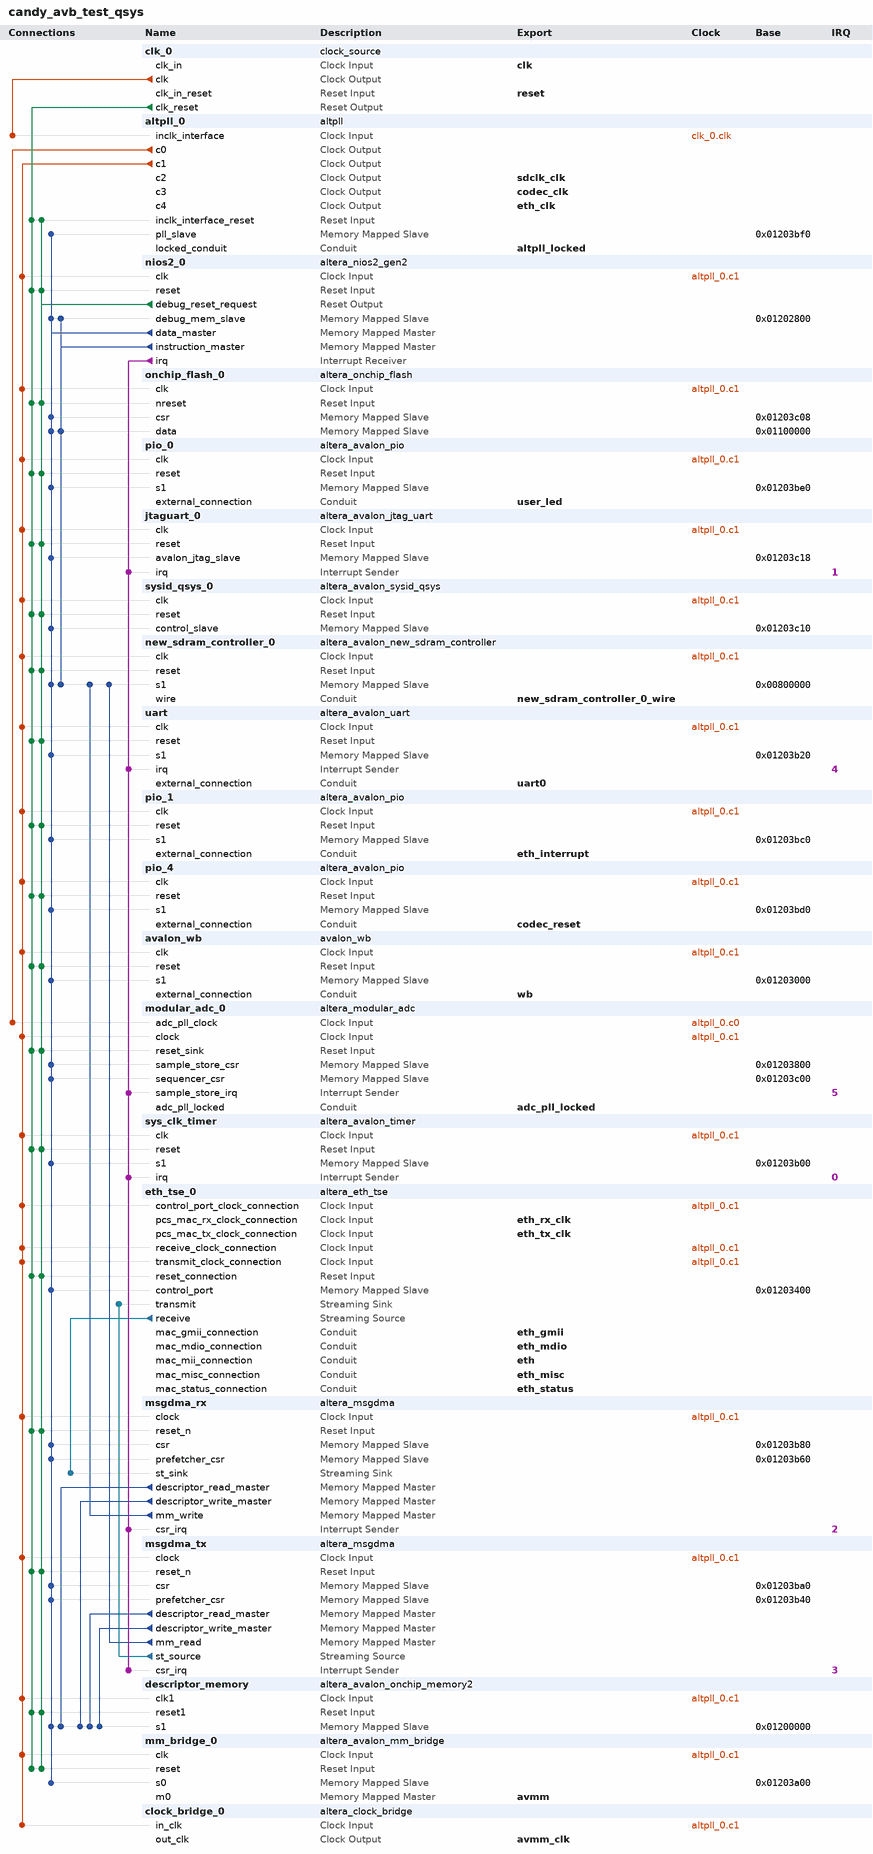
[diagram p0: system contents]
# Platform Designer (Qsys) system candy_avb_test_qsys, MAX 10 10M16SAU169C8G
# Parameters at their usual value, and those the tool derives, are not listed.
package require -exact qsys 18.1
create_system candy_avb_test_qsys
set_project_property DEVICE_FAMILY {MAX 10}
set_project_property DEVICE 10M16SAU169C8G

add_instance clk_0 clock_source 18.1
set_instance_parameter_value clk_0 clockFrequency 48000000

add_instance altpll_0 altpll 18.1
set_instance_parameter_value altpll_0 CLK0_DIVIDE_BY 24
set_instance_parameter_value altpll_0 CLK0_MULTIPLY_BY 5
set_instance_parameter_value altpll_0 CLK1_DIVIDE_BY 12
set_instance_parameter_value altpll_0 CLK1_DUTY_CYCLE 50
set_instance_parameter_value altpll_0 CLK1_MULTIPLY_BY 25
set_instance_parameter_value altpll_0 CLK1_PHASE_SHIFT 0
set_instance_parameter_value altpll_0 CLK2_DIVIDE_BY 12
set_instance_parameter_value altpll_0 CLK2_DUTY_CYCLE 50
set_instance_parameter_value altpll_0 CLK2_MULTIPLY_BY 25
set_instance_parameter_value altpll_0 CLK2_PHASE_SHIFT -83333
set_instance_parameter_value altpll_0 CLK3_DIVIDE_BY 2
set_instance_parameter_value altpll_0 CLK3_DUTY_CYCLE 50
set_instance_parameter_value altpll_0 CLK3_MULTIPLY_BY 1
set_instance_parameter_value altpll_0 CLK3_PHASE_SHIFT 0
set_instance_parameter_value altpll_0 CLK4_DIVIDE_BY 48
set_instance_parameter_value altpll_0 CLK4_DUTY_CYCLE 50
set_instance_parameter_value altpll_0 CLK4_MULTIPLY_BY 25
set_instance_parameter_value altpll_0 CLK4_PHASE_SHIFT 0
set_instance_parameter_value altpll_0 INCLK0_INPUT_FREQUENCY 20833
set_instance_parameter_value altpll_0 PORT_ARESET PORT_UNUSED
set_instance_parameter_value altpll_0 PORT_LOCKED PORT_USED
set_instance_parameter_value altpll_0 PORT_clk1 PORT_USED
set_instance_parameter_value altpll_0 PORT_clk2 PORT_USED
set_instance_parameter_value altpll_0 PORT_clk3 PORT_USED
set_instance_parameter_value altpll_0 PORT_clk4 PORT_USED

add_instance nios2_0 altera_nios2_gen2 18.1
set_instance_parameter_value nios2_0 dcache_size 2048
set_instance_parameter_value nios2_0 exceptionSlave new_sdram_controller_0.s1
set_instance_parameter_value nios2_0 icache_size 4096
set_instance_parameter_value nios2_0 impl Fast
set_instance_parameter_value nios2_0 resetSlave onchip_flash_0.data

add_instance onchip_flash_0 altera_onchip_flash 18.1
set_instance_parameter_value onchip_flash_0 CONFIGURATION_MODE {Single Uncompressed Image}
set_instance_parameter_value onchip_flash_0 READ_BURST_COUNT 4
set_instance_parameter_value onchip_flash_0 SECTOR_ACCESS_MODE {Read and write,Read and write,Read and write,Read and write,Read and write}
set_instance_parameter_value onchip_flash_0 initFlashContent false
set_instance_parameter_value onchip_flash_0 initializationFileName altera_onchip_flash.hex
set_instance_parameter_value onchip_flash_0 useNonDefaultInitFile false

add_instance pio_0 altera_avalon_pio 18.1
set_instance_parameter_value pio_0 direction Output
set_instance_parameter_value pio_0 width 2

add_instance jtaguart_0 altera_avalon_jtag_uart 18.1
set_instance_parameter_value jtaguart_0 simInteractiveOptions NO_INTERACTIVE_WINDOWS

add_instance sysid_qsys_0 altera_avalon_sysid_qsys 18.1
set_instance_parameter_value sysid_qsys_0 id 0

add_instance new_sdram_controller_0 altera_avalon_new_sdram_controller 18.1
set_instance_parameter_value new_sdram_controller_0 TAC 5.4
set_instance_parameter_value new_sdram_controller_0 TMRD 2
set_instance_parameter_value new_sdram_controller_0 TRCD 21.0
set_instance_parameter_value new_sdram_controller_0 TRFC 63.0
set_instance_parameter_value new_sdram_controller_0 TRP 42.0
set_instance_parameter_value new_sdram_controller_0 TWR 2.0
set_instance_parameter_value new_sdram_controller_0 casLatency 3
set_instance_parameter_value new_sdram_controller_0 columnWidth 8
set_instance_parameter_value new_sdram_controller_0 dataWidth 16
set_instance_parameter_value new_sdram_controller_0 generateSimulationModel false
set_instance_parameter_value new_sdram_controller_0 model single_Micron_MT48LC4M32B2_7_chip
set_instance_parameter_value new_sdram_controller_0 numberOfBanks 4
set_instance_parameter_value new_sdram_controller_0 numberOfChipSelects 1
set_instance_parameter_value new_sdram_controller_0 powerUpDelay 200.0
set_instance_parameter_value new_sdram_controller_0 refreshPeriod 15.6
set_instance_parameter_value new_sdram_controller_0 rowWidth 12

add_instance uart altera_avalon_uart 18.1
set_instance_parameter_value uart baud 115200
set_instance_parameter_value uart dataBits 8
set_instance_parameter_value uart fixedBaud true
set_instance_parameter_value uart parity NONE
set_instance_parameter_value uart stopBits 1
set_instance_parameter_value uart useCtsRts true

add_instance pio_1 altera_avalon_pio 18.1
set_instance_parameter_value pio_1 direction Bidir
set_instance_parameter_value pio_1 resetValue 1
set_instance_parameter_value pio_1 width 1

add_instance pio_4 altera_avalon_pio 18.1
set_instance_parameter_value pio_4 direction Output
set_instance_parameter_value pio_4 resetValue 1
set_instance_parameter_value pio_4 width 1

add_instance avalon_wb avalon_wb 1.0

add_instance modular_adc_0 altera_modular_adc 18.1
set_instance_parameter_value modular_adc_0 CLOCK_FREQ 100000000
set_instance_parameter_value modular_adc_0 CORE_VAR 0
set_instance_parameter_value modular_adc_0 DEVICE_PART 10M16SAU169C8G
set_instance_parameter_value modular_adc_0 clkdiv 2
set_instance_parameter_value modular_adc_0 int_vref_vr 3.3
set_instance_parameter_value modular_adc_0 refsel 1
set_instance_parameter_value modular_adc_0 sample_rate 0
set_instance_parameter_value modular_adc_0 seq_order_length 2
set_instance_parameter_value modular_adc_0 seq_order_slot_1 3
set_instance_parameter_value modular_adc_0 seq_order_slot_2 6
set_instance_parameter_value modular_adc_0 seq_order_slot_3 30
set_instance_parameter_value modular_adc_0 seq_order_slot_4 30
set_instance_parameter_value modular_adc_0 seq_order_slot_5 30
set_instance_parameter_value modular_adc_0 seq_order_slot_6 30
set_instance_parameter_value modular_adc_0 seq_order_slot_7 30
set_instance_parameter_value modular_adc_0 use_ch0 true
set_instance_parameter_value modular_adc_0 use_ch2 true
set_instance_parameter_value modular_adc_0 use_ch3 true
set_instance_parameter_value modular_adc_0 use_ch4 true
set_instance_parameter_value modular_adc_0 use_ch5 true
set_instance_parameter_value modular_adc_0 use_ch6 true
set_instance_parameter_value modular_adc_0 use_ch7 true
set_instance_parameter_value modular_adc_0 use_ch8 true
set_instance_parameter_value modular_adc_0 use_tsd false

add_instance sys_clk_timer altera_avalon_timer 18.1
set_instance_parameter_value sys_clk_timer fixedPeriod true
set_instance_parameter_value sys_clk_timer period 1
set_instance_parameter_value sys_clk_timer periodUnits MSEC

add_instance eth_tse_0 altera_eth_tse 18.1
set_instance_parameter_value eth_tse_0 XCVR_RCFG_JTAG_ENABLE 0
set_instance_parameter_value eth_tse_0 XCVR_SET_CAPABILITY_REG_ENABLE 0
set_instance_parameter_value eth_tse_0 XCVR_SET_CSR_SOFT_LOGIC_ENABLE 0
set_instance_parameter_value eth_tse_0 XCVR_SET_PRBS_SOFT_LOGIC_ENABLE 0
set_instance_parameter_value eth_tse_0 XCVR_SET_USER_IDENTIFIER 0
set_instance_parameter_value eth_tse_0 core_variation MAC_ONLY
set_instance_parameter_value eth_tse_0 eg_addr 8
set_instance_parameter_value eth_tse_0 enable_hd_logic true
set_instance_parameter_value eth_tse_0 enable_mac_flow_ctrl false
set_instance_parameter_value eth_tse_0 enable_magic_detect false
set_instance_parameter_value eth_tse_0 enable_shift16 true
set_instance_parameter_value eth_tse_0 ifGMII MII_GMII
set_instance_parameter_value eth_tse_0 ing_addr 8
set_instance_parameter_value eth_tse_0 mdio_clk_div 50
set_instance_parameter_value eth_tse_0 stat_cnt_ena true
set_instance_parameter_value eth_tse_0 transceiver_type NONE

add_instance msgdma_rx altera_msgdma 18.1
set_instance_parameter_value msgdma_rx BURST_ENABLE 0
set_instance_parameter_value msgdma_rx DATA_FIFO_DEPTH 256
set_instance_parameter_value msgdma_rx DATA_WIDTH 32
set_instance_parameter_value msgdma_rx DESCRIPTOR_FIFO_DEPTH 128
set_instance_parameter_value msgdma_rx ENHANCED_FEATURES 0
set_instance_parameter_value msgdma_rx ERROR_ENABLE 1
set_instance_parameter_value msgdma_rx ERROR_WIDTH 6
set_instance_parameter_value msgdma_rx MAX_BURST_COUNT 16
set_instance_parameter_value msgdma_rx MAX_BYTE 1024
set_instance_parameter_value msgdma_rx MODE 2
set_instance_parameter_value msgdma_rx PACKET_ENABLE 1
set_instance_parameter_value msgdma_rx PREFETCHER_ENABLE 1
set_instance_parameter_value msgdma_rx PREFETCHER_MAX_READ_BURST_COUNT 8
set_instance_parameter_value msgdma_rx TRANSFER_TYPE {Aligned Accesses}

add_instance msgdma_tx altera_msgdma 18.1
set_instance_parameter_value msgdma_tx BURST_ENABLE 0
set_instance_parameter_value msgdma_tx DATA_FIFO_DEPTH 256
set_instance_parameter_value msgdma_tx DATA_WIDTH 32
set_instance_parameter_value msgdma_tx DESCRIPTOR_FIFO_DEPTH 128
set_instance_parameter_value msgdma_tx ENHANCED_FEATURES 0
set_instance_parameter_value msgdma_tx ERROR_ENABLE 1
set_instance_parameter_value msgdma_tx ERROR_WIDTH 1
set_instance_parameter_value msgdma_tx MAX_BURST_COUNT 16
set_instance_parameter_value msgdma_tx MAX_BYTE 1024
set_instance_parameter_value msgdma_tx MODE 1
set_instance_parameter_value msgdma_tx PACKET_ENABLE 1
set_instance_parameter_value msgdma_tx PREFETCHER_ENABLE 1
set_instance_parameter_value msgdma_tx PREFETCHER_MAX_READ_BURST_COUNT 8
set_instance_parameter_value msgdma_tx TRANSFER_TYPE {Aligned Accesses}

add_instance descriptor_memory altera_avalon_onchip_memory2 18.1
set_instance_parameter_value descriptor_memory dataWidth 32
set_instance_parameter_value descriptor_memory dualPort false
set_instance_parameter_value descriptor_memory initMemContent false
set_instance_parameter_value descriptor_memory initializationFileName onchip_mem.hex
set_instance_parameter_value descriptor_memory memorySize 8192

add_instance mm_bridge_0 altera_avalon_mm_bridge 18.1
set_instance_parameter_value mm_bridge_0 ADDRESS_UNITS SYMBOLS
set_instance_parameter_value mm_bridge_0 ADDRESS_WIDTH 8
set_instance_parameter_value mm_bridge_0 DATA_WIDTH 32
set_instance_parameter_value mm_bridge_0 MAX_PENDING_RESPONSES 4
set_instance_parameter_value mm_bridge_0 PIPELINE_COMMAND 0
set_instance_parameter_value mm_bridge_0 PIPELINE_RESPONSE 0
set_instance_parameter_value mm_bridge_0 USE_AUTO_ADDRESS_WIDTH 0

add_instance clock_bridge_0 altera_clock_bridge 18.1
set_instance_parameter_value clock_bridge_0 DERIVED_CLOCK_RATE 100000000
set_instance_parameter_value clock_bridge_0 EXPLICIT_CLOCK_RATE 0

# connections
add_connection altpll_0.c0 modular_adc_0.adc_pll_clock clock
add_connection altpll_0.c1 avalon_wb.clk clock
add_connection altpll_0.c1 clock_bridge_0.in_clk clock
add_connection altpll_0.c1 descriptor_memory.clk1 clock
add_connection altpll_0.c1 eth_tse_0.control_port_clock_connection clock
add_connection altpll_0.c1 eth_tse_0.receive_clock_connection clock
add_connection altpll_0.c1 eth_tse_0.transmit_clock_connection clock
add_connection altpll_0.c1 jtaguart_0.clk clock
add_connection altpll_0.c1 mm_bridge_0.clk clock
add_connection altpll_0.c1 modular_adc_0.clock clock
add_connection altpll_0.c1 msgdma_rx.clock clock
add_connection altpll_0.c1 msgdma_tx.clock clock
add_connection altpll_0.c1 new_sdram_controller_0.clk clock
add_connection altpll_0.c1 nios2_0.clk clock
add_connection altpll_0.c1 onchip_flash_0.clk clock
add_connection altpll_0.c1 pio_0.clk clock
add_connection altpll_0.c1 pio_1.clk clock
add_connection altpll_0.c1 pio_4.clk clock
add_connection altpll_0.c1 sys_clk_timer.clk clock
add_connection altpll_0.c1 sysid_qsys_0.clk clock
add_connection altpll_0.c1 uart.clk clock
add_connection clk_0.clk altpll_0.inclk_interface clock
add_connection clk_0.clk_reset altpll_0.inclk_interface_reset reset
add_connection clk_0.clk_reset avalon_wb.reset reset
add_connection clk_0.clk_reset descriptor_memory.reset1 reset
add_connection clk_0.clk_reset eth_tse_0.reset_connection reset
add_connection clk_0.clk_reset jtaguart_0.reset reset
add_connection clk_0.clk_reset mm_bridge_0.reset reset
add_connection clk_0.clk_reset modular_adc_0.reset_sink reset
add_connection clk_0.clk_reset msgdma_rx.reset_n reset
add_connection clk_0.clk_reset msgdma_tx.reset_n reset
add_connection clk_0.clk_reset new_sdram_controller_0.reset reset
add_connection clk_0.clk_reset nios2_0.reset reset
add_connection clk_0.clk_reset onchip_flash_0.nreset reset
add_connection clk_0.clk_reset pio_0.reset reset
add_connection clk_0.clk_reset pio_1.reset reset
add_connection clk_0.clk_reset pio_4.reset reset
add_connection clk_0.clk_reset sys_clk_timer.reset reset
add_connection clk_0.clk_reset sysid_qsys_0.reset reset
add_connection clk_0.clk_reset uart.reset reset
add_connection nios2_0.debug_reset_request altpll_0.inclk_interface_reset reset
add_connection nios2_0.debug_reset_request avalon_wb.reset reset
add_connection nios2_0.debug_reset_request descriptor_memory.reset1 reset
add_connection nios2_0.debug_reset_request eth_tse_0.reset_connection reset
add_connection nios2_0.debug_reset_request jtaguart_0.reset reset
add_connection nios2_0.debug_reset_request mm_bridge_0.reset reset
add_connection nios2_0.debug_reset_request modular_adc_0.reset_sink reset
add_connection nios2_0.debug_reset_request msgdma_rx.reset_n reset
add_connection nios2_0.debug_reset_request msgdma_tx.reset_n reset
add_connection nios2_0.debug_reset_request new_sdram_controller_0.reset reset
add_connection nios2_0.debug_reset_request nios2_0.reset reset
add_connection nios2_0.debug_reset_request onchip_flash_0.nreset reset
add_connection nios2_0.debug_reset_request pio_0.reset reset
add_connection nios2_0.debug_reset_request pio_1.reset reset
add_connection nios2_0.debug_reset_request pio_4.reset reset
add_connection nios2_0.debug_reset_request sys_clk_timer.reset reset
add_connection nios2_0.debug_reset_request sysid_qsys_0.reset reset
add_connection nios2_0.debug_reset_request uart.reset reset
add_connection msgdma_rx.descriptor_read_master descriptor_memory.s1 avalon
set_connection_parameter_value msgdma_rx.descriptor_read_master/descriptor_memory.s1 baseAddress 0x01200000
add_connection msgdma_rx.descriptor_write_master descriptor_memory.s1 avalon
set_connection_parameter_value msgdma_rx.descriptor_write_master/descriptor_memory.s1 baseAddress 0x01200000
add_connection msgdma_rx.mm_write new_sdram_controller_0.s1 avalon
set_connection_parameter_value msgdma_rx.mm_write/new_sdram_controller_0.s1 baseAddress 0x00800000
add_connection msgdma_tx.descriptor_read_master descriptor_memory.s1 avalon
set_connection_parameter_value msgdma_tx.descriptor_read_master/descriptor_memory.s1 baseAddress 0x01200000
add_connection msgdma_tx.descriptor_write_master descriptor_memory.s1 avalon
set_connection_parameter_value msgdma_tx.descriptor_write_master/descriptor_memory.s1 baseAddress 0x01200000
add_connection msgdma_tx.mm_read new_sdram_controller_0.s1 avalon
set_connection_parameter_value msgdma_tx.mm_read/new_sdram_controller_0.s1 baseAddress 0x00800000
add_connection nios2_0.data_master altpll_0.pll_slave avalon
set_connection_parameter_value nios2_0.data_master/altpll_0.pll_slave baseAddress 0x01203bf0
add_connection nios2_0.data_master avalon_wb.s1 avalon
set_connection_parameter_value nios2_0.data_master/avalon_wb.s1 baseAddress 0x01203000
add_connection nios2_0.data_master descriptor_memory.s1 avalon
set_connection_parameter_value nios2_0.data_master/descriptor_memory.s1 baseAddress 0x01200000
add_connection nios2_0.data_master eth_tse_0.control_port avalon
set_connection_parameter_value nios2_0.data_master/eth_tse_0.control_port baseAddress 0x01203400
add_connection nios2_0.data_master jtaguart_0.avalon_jtag_slave avalon
set_connection_parameter_value nios2_0.data_master/jtaguart_0.avalon_jtag_slave baseAddress 0x01203c18
add_connection nios2_0.data_master mm_bridge_0.s0 avalon
set_connection_parameter_value nios2_0.data_master/mm_bridge_0.s0 baseAddress 0x01203a00
add_connection nios2_0.data_master modular_adc_0.sample_store_csr avalon
set_connection_parameter_value nios2_0.data_master/modular_adc_0.sample_store_csr baseAddress 0x01203800
add_connection nios2_0.data_master modular_adc_0.sequencer_csr avalon
set_connection_parameter_value nios2_0.data_master/modular_adc_0.sequencer_csr baseAddress 0x01203c00
add_connection nios2_0.data_master msgdma_rx.csr avalon
set_connection_parameter_value nios2_0.data_master/msgdma_rx.csr baseAddress 0x01203b80
add_connection nios2_0.data_master msgdma_rx.prefetcher_csr avalon
set_connection_parameter_value nios2_0.data_master/msgdma_rx.prefetcher_csr baseAddress 0x01203b60
add_connection nios2_0.data_master msgdma_tx.csr avalon
set_connection_parameter_value nios2_0.data_master/msgdma_tx.csr baseAddress 0x01203ba0
add_connection nios2_0.data_master msgdma_tx.prefetcher_csr avalon
set_connection_parameter_value nios2_0.data_master/msgdma_tx.prefetcher_csr baseAddress 0x01203b40
add_connection nios2_0.data_master new_sdram_controller_0.s1 avalon
set_connection_parameter_value nios2_0.data_master/new_sdram_controller_0.s1 baseAddress 0x00800000
add_connection nios2_0.data_master nios2_0.debug_mem_slave avalon
set_connection_parameter_value nios2_0.data_master/nios2_0.debug_mem_slave baseAddress 0x01202800
add_connection nios2_0.data_master onchip_flash_0.csr avalon
set_connection_parameter_value nios2_0.data_master/onchip_flash_0.csr baseAddress 0x01203c08
add_connection nios2_0.data_master onchip_flash_0.data avalon
set_connection_parameter_value nios2_0.data_master/onchip_flash_0.data baseAddress 0x01100000
add_connection nios2_0.data_master pio_0.s1 avalon
set_connection_parameter_value nios2_0.data_master/pio_0.s1 baseAddress 0x01203be0
add_connection nios2_0.data_master pio_1.s1 avalon
set_connection_parameter_value nios2_0.data_master/pio_1.s1 baseAddress 0x01203bc0
add_connection nios2_0.data_master pio_4.s1 avalon
set_connection_parameter_value nios2_0.data_master/pio_4.s1 baseAddress 0x01203bd0
add_connection nios2_0.data_master sys_clk_timer.s1 avalon
set_connection_parameter_value nios2_0.data_master/sys_clk_timer.s1 baseAddress 0x01203b00
add_connection nios2_0.data_master sysid_qsys_0.control_slave avalon
set_connection_parameter_value nios2_0.data_master/sysid_qsys_0.control_slave baseAddress 0x01203c10
add_connection nios2_0.data_master uart.s1 avalon
set_connection_parameter_value nios2_0.data_master/uart.s1 baseAddress 0x01203b20
add_connection nios2_0.instruction_master new_sdram_controller_0.s1 avalon
set_connection_parameter_value nios2_0.instruction_master/new_sdram_controller_0.s1 baseAddress 0x00800000
add_connection nios2_0.instruction_master nios2_0.debug_mem_slave avalon
set_connection_parameter_value nios2_0.instruction_master/nios2_0.debug_mem_slave baseAddress 0x01202800
add_connection nios2_0.instruction_master onchip_flash_0.data avalon
set_connection_parameter_value nios2_0.instruction_master/onchip_flash_0.data baseAddress 0x01100000
add_connection eth_tse_0.receive msgdma_rx.st_sink avalon_streaming
add_connection msgdma_tx.st_source eth_tse_0.transmit avalon_streaming
add_connection nios2_0.irq jtaguart_0.irq interrupt
set_connection_parameter_value nios2_0.irq/jtaguart_0.irq irqNumber 1
add_connection nios2_0.irq modular_adc_0.sample_store_irq interrupt
set_connection_parameter_value nios2_0.irq/modular_adc_0.sample_store_irq irqNumber 5
add_connection nios2_0.irq msgdma_rx.csr_irq interrupt
set_connection_parameter_value nios2_0.irq/msgdma_rx.csr_irq irqNumber 2
add_connection nios2_0.irq msgdma_tx.csr_irq interrupt
set_connection_parameter_value nios2_0.irq/msgdma_tx.csr_irq irqNumber 3
add_connection nios2_0.irq sys_clk_timer.irq interrupt
set_connection_parameter_value nios2_0.irq/sys_clk_timer.irq irqNumber 0
add_connection nios2_0.irq uart.irq interrupt
set_connection_parameter_value nios2_0.irq/uart.irq irqNumber 4

# exported interfaces
add_interface adc_pll_locked conduit end
set_interface_property adc_pll_locked EXPORT_OF modular_adc_0.adc_pll_locked
add_interface altpll_locked conduit end
set_interface_property altpll_locked EXPORT_OF altpll_0.locked_conduit
add_interface avmm avalon master
set_interface_property avmm EXPORT_OF mm_bridge_0.m0
add_interface avmm_clk clock source
set_interface_property avmm_clk EXPORT_OF clock_bridge_0.out_clk
add_interface clk clock sink
set_interface_property clk EXPORT_OF clk_0.clk_in
add_interface codec_clk clock source
set_interface_property codec_clk EXPORT_OF altpll_0.c3
add_interface codec_reset conduit end
set_interface_property codec_reset EXPORT_OF pio_4.external_connection
add_interface eth conduit end
set_interface_property eth EXPORT_OF eth_tse_0.mac_mii_connection
add_interface eth_clk clock source
set_interface_property eth_clk EXPORT_OF altpll_0.c4
add_interface eth_gmii conduit end
set_interface_property eth_gmii EXPORT_OF eth_tse_0.mac_gmii_connection
add_interface eth_interrupt conduit end
set_interface_property eth_interrupt EXPORT_OF pio_1.external_connection
add_interface eth_mdio conduit end
set_interface_property eth_mdio EXPORT_OF eth_tse_0.mac_mdio_connection
add_interface eth_misc conduit end
set_interface_property eth_misc EXPORT_OF eth_tse_0.mac_misc_connection
add_interface eth_rx_clk clock sink
set_interface_property eth_rx_clk EXPORT_OF eth_tse_0.pcs_mac_rx_clock_connection
add_interface eth_status conduit end
set_interface_property eth_status EXPORT_OF eth_tse_0.mac_status_connection
add_interface eth_tx_clk clock sink
set_interface_property eth_tx_clk EXPORT_OF eth_tse_0.pcs_mac_tx_clock_connection
add_interface new_sdram_controller_0_wire conduit end
set_interface_property new_sdram_controller_0_wire EXPORT_OF new_sdram_controller_0.wire
add_interface reset reset sink
set_interface_property reset EXPORT_OF clk_0.clk_in_reset
add_interface sdclk_clk clock source
set_interface_property sdclk_clk EXPORT_OF altpll_0.c2
add_interface uart0 conduit end
set_interface_property uart0 EXPORT_OF uart.external_connection
add_interface user_led conduit end
set_interface_property user_led EXPORT_OF pio_0.external_connection
add_interface wb conduit end
set_interface_property wb EXPORT_OF avalon_wb.external_connection

set_interconnect_requirement {$system} qsys_mm.clockCrossingAdapter HANDSHAKE
set_interconnect_requirement {$system} qsys_mm.enableEccProtection FALSE
set_interconnect_requirement {$system} qsys_mm.insertDefaultSlave FALSE
set_interconnect_requirement {$system} qsys_mm.maxAdditionalLatency 1

save_system candy_avb_test_qsys.qsys
